# Altium project PowerSwitch-SolidState.PrjPCB
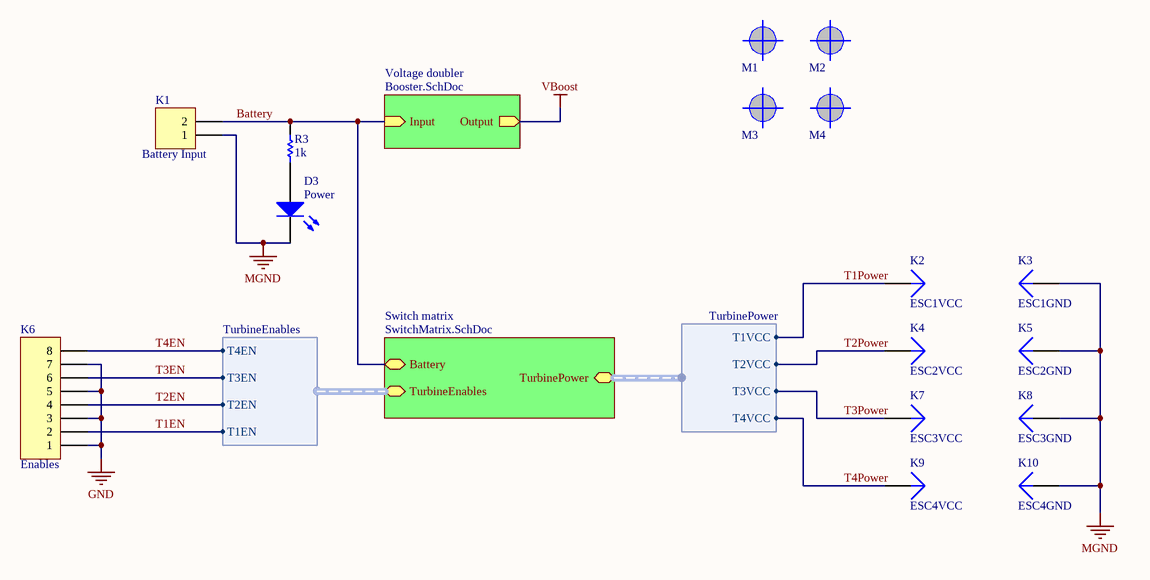
[diagram p0: PowerSwitchBoard.SchDoc]
4 sheets, 63 parts. Net scope: hierarchical (ports join the sheet entries above them; power ports are global).
Board file: PowerSwitchBoard.PcbDoc
Sheets:
  PowerSwitchBoard.SchDoc
    Switch matrix = SwitchMatrix.SchDoc
      SwitchTurbine1 = Switch.SchDoc
      SwitchTurbine2 = Switch.SchDoc
      SwitchTurbine3 = Switch.SchDoc
      SwitchTurbine4 = Switch.SchDoc
    Voltage doubler = Booster.SchDoc

## Sheet PowerSwitchBoard.SchDoc
size A4

### Parts
D3  Power  [LED-3MM-GREEN]
K1  Battery Input  [CONN-SB-0.2-2WAY]
K2  ESC1VCC  [CONN-BULLET-3.5-HF]
K3  ESC1GND  [CONN-BULLET-3.5-HF]
K4  ESC2VCC  [CONN-BULLET-3.5-HF]
K5  ESC2GND  [CONN-BULLET-3.5-HF]
K6  Enables  [CONN-HDR-0.1-1x8-SOCKH]
K7  ESC3VCC  [CONN-BULLET-3.5-HF]
K8  ESC3GND  [CONN-BULLET-3.5-HF]
K9  ESC4VCC  [CONN-BULLET-3.5-HF]
K10  ESC4GND  [CONN-BULLET-3.5-HF]
M1  Fiducial  [MECH-FID-ALL]  (value not drawn)
M2  Fiducial  [MECH-FID-ALL]  (value not drawn)
M3  Fiducial  [MECH-FID-ALL]  (value not drawn)
M4  Fiducial  [MECH-FID-ALL]  (value not drawn)
R3  1k  [RES-0.4]

### Sub-sheets
Switch matrix = SwitchMatrix.SchDoc: Battery, TurbinePower (harness TurbinePower), TurbineEnables (harness TurbineEnables)
Voltage doubler = Booster.SchDoc: Input (in), Output (out)

### Harnesses
TurbinePower: T1VCC, T2VCC, T3VCC, T4VCC
TurbineEnables: T1EN, T2EN, T3EN, T4EN

### Nets
GND: K6.1 K6.3 K6.5 K6.7
MGND: D3.2(K) K1.1 K3.1 K5.1 K8.1 K10.1
Battery: K1.2 R3.1 ; sheet Switch matrix/Battery, sheet Voltage doubler/Input  [project net Batt]
T1EN: K6.2 ; sheet Switch matrix/TurbineEnables.T1EN
T1Power: K2.1 ; sheet Switch matrix/TurbinePower.T1VCC
T2EN: K6.4 ; sheet Switch matrix/TurbineEnables.T2EN
T2Power: K4.1 ; sheet Switch matrix/TurbinePower.T2VCC
T3EN: K6.6 ; sheet Switch matrix/TurbineEnables.T3EN
T3Power: K7.1 ; sheet Switch matrix/TurbinePower.T3VCC
T4EN: K6.8 ; sheet Switch matrix/TurbineEnables.T4EN
T4Power: K9.1 ; sheet Switch matrix/TurbinePower.T4VCC
NetD3_1: D3.1(A) R3.2

### Library data of the parts
D3 = LED0: Typical 3mm green LED; Published: 8-Jun-2000; LatestRevisionDate: 08-Jul-2005; LatestRevisionNote: Mech Layer 1 removed.; PackageReference: LED-0; Publisher: Altium Limited; PackageDescription: LED; 2 Leads
K1 = Header 2: Header, 2-Pin; LatestRevisionDate: 17-Jul-2002; LatestRevisionNote: Re-released for DXP Platform.; Publisher: Altium Limited
K2-K5 K7-K10 = Plug: LatestRevisionDate: 17-Jul-2002; LatestRevisionNote: Re-released for DXP Platform.; Publisher: Altium Limited
K6 = Header 8H: Header, 8-Pin, Right Angle; LatestRevisionDate: 17-Jul-2002; LatestRevisionNote: Re-released for DXP Platform.; Publisher: Altium Limited
M1-M4 = Fiducial: Fiducial marking
R3 = Res1: Resistor; Published: 8-Jun-2000; LatestRevisionDate: 17-Jul-2002; LatestRevisionNote: Re-released for DXP Platform.; PackageReference: AXIAL-0.3; Publisher: Altium Limited; PackageDescription: Axial Device, Thru-Hole; 2 Leads; 0.3 in Pin Spacing; Value: 1k

## Sheet SwitchMatrix.SchDoc
size A4
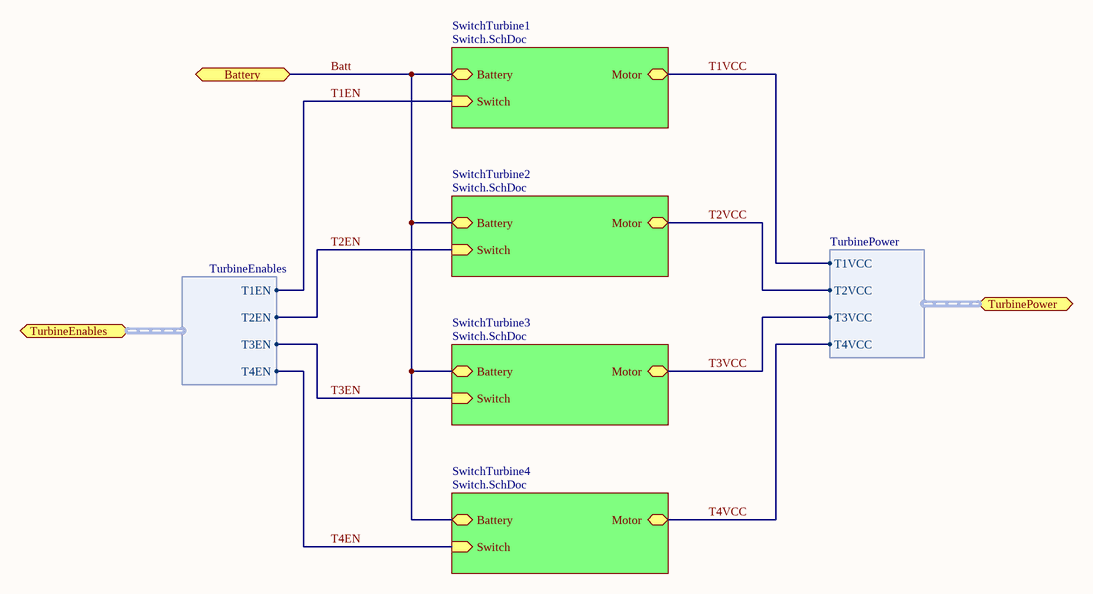
[diagram p1: SwitchMatrix.SchDoc]

### Sub-sheets
SwitchTurbine1 = Switch.SchDoc: Battery, Motor, Switch (in)
SwitchTurbine2 = Switch.SchDoc: Battery, Motor, Switch (in)
SwitchTurbine3 = Switch.SchDoc: Battery, Motor, Switch (in)
SwitchTurbine4 = Switch.SchDoc: Battery, Motor, Switch (in)

### Ports
Battery, TurbineEnables (harness TurbineEnables), TurbinePower (harness TurbinePower)

### Harnesses
TurbinePower: T1VCC, T2VCC, T3VCC, T4VCC
TurbineEnables: T1EN, T2EN, T3EN, T4EN

### Nets
Batt: port Battery, sheet SwitchTurbine1/Battery, sheet SwitchTurbine2/Battery, sheet SwitchTurbine3/Battery, sheet SwitchTurbine4/Battery
T1EN: sheet SwitchTurbine1/Switch, port TurbineEnables.T1EN
T1VCC: sheet SwitchTurbine1/Motor, port TurbinePower.T1VCC  [project net T1Power]
T2EN: sheet SwitchTurbine2/Switch, port TurbineEnables.T2EN
T2VCC: sheet SwitchTurbine2/Motor, port TurbinePower.T2VCC  [project net T2Power]
T3EN: sheet SwitchTurbine3/Switch, port TurbineEnables.T3EN
T3VCC: sheet SwitchTurbine3/Motor, port TurbinePower.T3VCC  [project net T3Power]
T4EN: sheet SwitchTurbine4/Switch, port TurbineEnables.T4EN
T4VCC: sheet SwitchTurbine4/Motor, port TurbinePower.T4VCC  [project net T4Power]

## Sheet Switch.SchDoc
size A4
Used 4 times, as channels Switch matrix/SwitchTurbine1, Switch matrix/SwitchTurbine2, Switch matrix/SwitchTurbine3, Switch matrix/SwitchTurbine4. Parts and nets are listed once, with the designators drawn on the sheet.
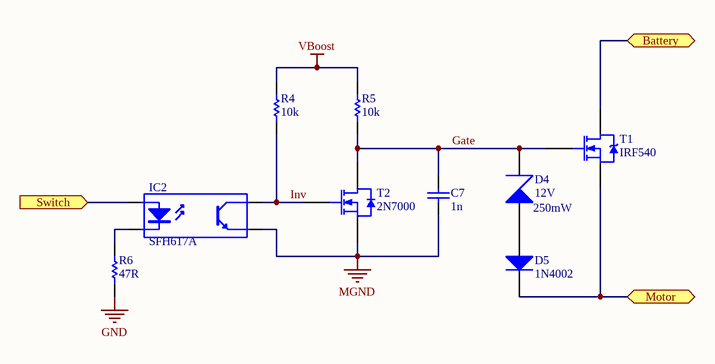
[diagram p2: Switch.SchDoc]

### Parts
C7  1n  [CAP-0.4-FILM]
D4  12V  Power: 250mW  [DIODE-0.3-ZENER]
D5  1N4002  [DIODE-0.3-SI]
IC2  SFH617A  [IC-DIP-4]
R4  10k  [RES-0.6]
R5  10k  [RES-0.6]
R6  47R  [RES-0.4]
T1  IRF540  [TO-220H]
T2  2N7000  [TO-92-T]

### Ports
Battery, Motor, Switch (in)

### Nets
GND: R6.2
MGND: C7.1 IC2.3(E) T2.3(S)
VBoost: R4.1 R5.1
Battery: T1.2(D) ; port Battery
Gate: C7.2 D4.2(K) R5.2 T1.1(G) T2.1(D)
Inv: IC2.4(C) R4.2 T2.2(G)
Motor: D5.2(K) T1.3(S) ; port Motor
Switch: IC2.1(A) ; port Switch
NetD4_1: D4.1(A) D5.1(A)
NetIC2_2: IC2.2(K) R6.1

### Channels
Switch matrix/SwitchTurbine1: designators end in _SwitchTurbine1; ports Battery=Batt Motor=T1Power Switch=T1EN
Switch matrix/SwitchTurbine2: designators end in _SwitchTurbine2; ports Battery=Batt Motor=T2Power Switch=T2EN
Switch matrix/SwitchTurbine3: designators end in _SwitchTurbine3; ports Battery=Batt Motor=T3Power Switch=T3EN
Switch matrix/SwitchTurbine4: designators end in _SwitchTurbine4; ports Battery=Batt Motor=T4Power Switch=T4EN

### Library data of the parts
C7 = Cap: Capacitor; Published: 8-Jun-2000; LatestRevisionDate: 17-Jul-2002; LatestRevisionNote: Re-released for DXP Platform.; PackageReference: RAD-0.3; Publisher: Altium Limited; PackageDescription: Radial Cap, Thru-Hole; 2 Leads; 0.3 in Pin Spacing; Value: 1n
D4 = Diode Zener: Zener Diode; Published: 8-Jun-2000; LatestRevisionDate: 17-Jul-2002; LatestRevisionNote: Re-released for DXP Platform.; PackageReference: DIODE-0.7; Publisher: Altium Limited; PackageDescription: Diode, Thru-Hole; 2 Leads; 0.7 in Pin Spacing; Voltage: 12V
D5 = Diode 1N4002: 1 Amp General Purpose Rectifier; Published: 8-Jun-2000; LatestRevisionDate: 17-Jul-2002; LatestRevisionNote: Re-released for DXP Platform.; DatasheetVersion: 1998; PackageVersion: Aug-1999; PackageReference: DO-41; Publisher: Altium Limited; PackageDescription: Diode, Axial; Body 5.2 x 2.7 mm (LxDia. max), Lead Dia. 0.86 mm (max); Code_JEDEC: DO-204-AL; ComponentLink1Description: Manufacturer Link; ComponentLink1URL: http://www.fairchildsemi.com/; ComponentLink2Description: Datasheet; ComponentLink2URL: http://www.fairchildsemi.com/ds/1N%2F1N4001.pdf
IC2 = Optoisolator1: 4-Pin Phototransistor Optocoupler; Published: 24-Mar-1999; LatestRevisionDate: 04-Mar-2005; LatestRevisionNote: Sch pins 3 & 4 Swapped.; DatasheetVersion: Nov-2003; PackageReference: DIP-4; Publisher: Altium Limited; Datasheet: http://www.vishay.com/docs/83740/sfh617a.pdf
R4-R6 = Res1: Resistor; Published: 8-Jun-2000; LatestRevisionDate: 17-Jul-2002; LatestRevisionNote: Re-released for DXP Platform.; PackageReference: AXIAL-0.3; Publisher: Altium Limited; PackageDescription: Axial Device, Thru-Hole; 2 Leads; 0.3 in Pin Spacing
  R4 R5: Value: 10k
  R6: Value: 47R
T1 = IRF540: HEXFET N-Channel Power MOSFET; Note: Pin 2 is electrically connected to pin 4.; Published: 8-Jun-2000; LatestRevisionDate: 17-Jul-2002; LatestRevisionNote: Re-released for DXP Platform.; DatasheetVersion: PD-9.373H; PackageVersion: Feb-1997; PackageReference: TO-220AB; Publisher: Altium Limited; PackageDescription: TO, Thru-Hole, Vertical, Heatsink Mounted; 3 In-Line Leads; Pitch 2.54 mm; ComponentLink1Description: Manufacturer Link; ComponentLink1URL: http://www.irf.com/
T2 = 2N7000: N-channel Enhancement Mode Field-effect Transistor; Published: 17-Sep-2003; DatasheetVersion: 19-May-2000; PackageVersion: rev3, May-2000; PackageReference: SOT54; Publisher: Altium Limited; PackageDescription: TO, Flat Index; 3 In-Line, Axial Leads; Body Dia. 4.6mm; Leads 0.48 x 0.45 mm (max); Code_JEDEC: TO-92; ComponentLink1Description: Manufacturer Link; ComponentLink1URL: http://www.semiconductors.philips.com/; ComponentLink2Description: Datasheet; ComponentLink2URL: http://www.semiconductors.philips.com/acrobat/datasheets/2N7000-03.pdf

## Sheet Booster.SchDoc
size A4
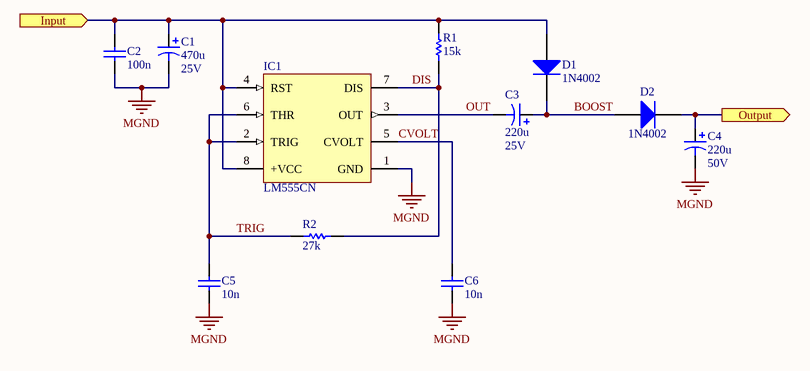
[diagram p3: Booster.SchDoc]

### Parts
C1  470u  Voltage: 25V  [CAP-5-ELCO-10x12.5]
C2  100n  [CAP-0.2-CERA]
C3  220u  Voltage: 25V  [CAP-5-ELCO-10x16]
C4  220u  Voltage: 50V  [CAP-5-ELCO-10x16]
C5  10n  [CAP-0.1-CERA2]
C6  10n  [CAP-0.1-CERA2]
D1  1N4002  [DIODE-0.3-SI]
D2  1N4002  [DIODE-0.3-SI]
IC1  LM555CN  [IC-DIP-8]
R1  15k  [RES-0.4]
R2  27k  [RES-0.4]

### Ports
Input (in), Output (out)

### Nets
MGND: C1.2 C2.1 C4.2 C5.1 C6.1 IC1.1(GND)
VBoost: C4.1 D2.2(K) ; port Output
Batt: C1.1 C2.2 D1.1(A) IC1.4(RST) IC1.8(+VCC) R1.1 ; port Input
BOOST: C3.1 D1.2(K) D2.1(A)
CVOLT: C6.2 IC1.5(CVOLT)
DIS: IC1.7(DIS) R1.2 R2.2
OUT: C3.2 IC1.3(OUT)
TRIG: C5.2 IC1.2(TRIG) IC1.6(THR) R2.1

### Library data of the parts
C1 C3 C4 = Cap Pol3: Polarized Capacitor (Surface Mount); Published: 8-Jun-2000; LatestRevisionDate: 29-May-2009; LatestRevisionNote: IPC-7351 Footprint Added.; PackageReference: C0805; Publisher: Altium Limited; PackageDescription: Chip Capacitor
  C1: Value: 470u
  C3 C4: Value: 220u
C2 C5 C6 = Cap: Capacitor; Published: 8-Jun-2000; LatestRevisionDate: 17-Jul-2002; LatestRevisionNote: Re-released for DXP Platform.; PackageReference: RAD-0.3; Publisher: Altium Limited; PackageDescription: Radial Cap, Thru-Hole; 2 Leads; 0.3 in Pin Spacing
  C2: Value: 100n
  C5 C6: Value: 10n
D1 D2 = Diode 1N4002: 1 Amp General Purpose Rectifier; Published: 8-Jun-2000; LatestRevisionDate: 17-Jul-2002; LatestRevisionNote: Re-released for DXP Platform.; DatasheetVersion: 1998; PackageVersion: Aug-1999; PackageReference: DO-41; Publisher: Altium Limited; PackageDescription: Diode, Axial; Body 5.2 x 2.7 mm (LxDia. max), Lead Dia. 0.86 mm (max); Code_JEDEC: DO-204-AL; ComponentLink1Description: Manufacturer Link; ComponentLink1URL: http://www.fairchildsemi.com/; ComponentLink2Description: Datasheet; ComponentLink2URL: http://www.fairchildsemi.com/ds/1N%2F1N4001.pdf
IC1 = LM555CN: Timer; Manufacturer: National Semiconductor; CompType: Analog IC; PackageTopMarking: NSUZXYTT*LM*555CN; PowerWise: N; Published: 4-Dec-2008; DatasheetVersion: Jul-2006; PackageVersion: revG, May-2006; PackageReference: N08E; Publisher: Altium Limited; PackageDescription: MDIP, .365 x .250 x .130in, 8 Lead, .100in Pitch; PartNumber: LM555CN; PinCount: 8; DigiKeyPartNumber: LM555CNNS-ND; Code_JEDEC: MS-001-BA; ComponentLink1Description: LM555 Datasheet; ComponentLink1URL: http://www.national.com/ds.cgi/LM/LM555.pdf; ComponentLink2Description: LM555 Web Page; ComponentLink2URL: http://www.national.com/pf/LM/LM555.html; ComponentLink3Description: N08E package page; ComponentLink3URL: http://www.national.com/packaging/folders/n08e.html
R1 R2 = Res1: Resistor; Published: 8-Jun-2000; LatestRevisionDate: 17-Jul-2002; LatestRevisionNote: Re-released for DXP Platform.; PackageReference: AXIAL-0.3; Publisher: Altium Limited; PackageDescription: Axial Device, Thru-Hole; 2 Leads; 0.3 in Pin Spacing
  R1: Value: 15k
  R2: Value: 27k

## Nets that join several sheets
GND: PowerSwitchBoard (K6.1 K6.3 K6.5 K6.7), Switch matrix/SwitchTurbine1 (R6_SwitchTurbine1.2), Switch matrix/SwitchTurbine2 (R6_SwitchTurbine2.2), Switch matrix/SwitchTurbine3 (R6_SwitchTurbine3.2), Switch matrix/SwitchTurbine4 (R6_SwitchTurbine4.2)
MGND: PowerSwitchBoard (6 pins), Switch matrix/SwitchTurbine1 (C7_SwitchTurbine1.1 IC2_SwitchTurbine1.3 T2_SwitchTurbine1.3), Switch matrix/SwitchTurbine2 (C7_SwitchTurbine2.1 IC2_SwitchTurbine2.3 T2_SwitchTurbine2.3), Switch matrix/SwitchTurbine3 (C7_SwitchTurbine3.1 IC2_SwitchTurbine3.3 T2_SwitchTurbine3.3), Switch matrix/SwitchTurbine4 (C7_SwitchTurbine4.1 IC2_SwitchTurbine4.3 T2_SwitchTurbine4.3), Booster (6 pins)
VBoost: Switch matrix/SwitchTurbine1 (R4_SwitchTurbine1.1 R5_SwitchTurbine1.1), Switch matrix/SwitchTurbine2 (R4_SwitchTurbine2.1 R5_SwitchTurbine2.1), Switch matrix/SwitchTurbine3 (R4_SwitchTurbine3.1 R5_SwitchTurbine3.1), Switch matrix/SwitchTurbine4 (R4_SwitchTurbine4.1 R5_SwitchTurbine4.1), Booster (C4.1 D2.2)
Batt: PowerSwitchBoard (K1.2 R3.1), Switch matrix/SwitchTurbine1 (T1_SwitchTurbine1.2), Switch matrix/SwitchTurbine2 (T1_SwitchTurbine2.2), Switch matrix/SwitchTurbine3 (T1_SwitchTurbine3.2), Switch matrix/SwitchTurbine4 (T1_SwitchTurbine4.2), Booster (6 pins)
T1EN: PowerSwitchBoard (K6.2), Switch matrix/SwitchTurbine1 (IC2_SwitchTurbine1.1)
T1Power: PowerSwitchBoard (K2.1), Switch matrix/SwitchTurbine1 (D5_SwitchTurbine1.2 T1_SwitchTurbine1.3)
T2EN: PowerSwitchBoard (K6.4), Switch matrix/SwitchTurbine2 (IC2_SwitchTurbine2.1)
T2Power: PowerSwitchBoard (K4.1), Switch matrix/SwitchTurbine2 (D5_SwitchTurbine2.2 T1_SwitchTurbine2.3)
T3EN: PowerSwitchBoard (K6.6), Switch matrix/SwitchTurbine3 (IC2_SwitchTurbine3.1)
T3Power: PowerSwitchBoard (K7.1), Switch matrix/SwitchTurbine3 (D5_SwitchTurbine3.2 T1_SwitchTurbine3.3)
T4EN: PowerSwitchBoard (K6.8), Switch matrix/SwitchTurbine4 (IC2_SwitchTurbine4.1)
T4Power: PowerSwitchBoard (K9.1), Switch matrix/SwitchTurbine4 (D5_SwitchTurbine4.2 T1_SwitchTurbine4.3)